# EAGLE design PIC 16F877A Board_V3 (SMD) (EAGLE 9.6.2)
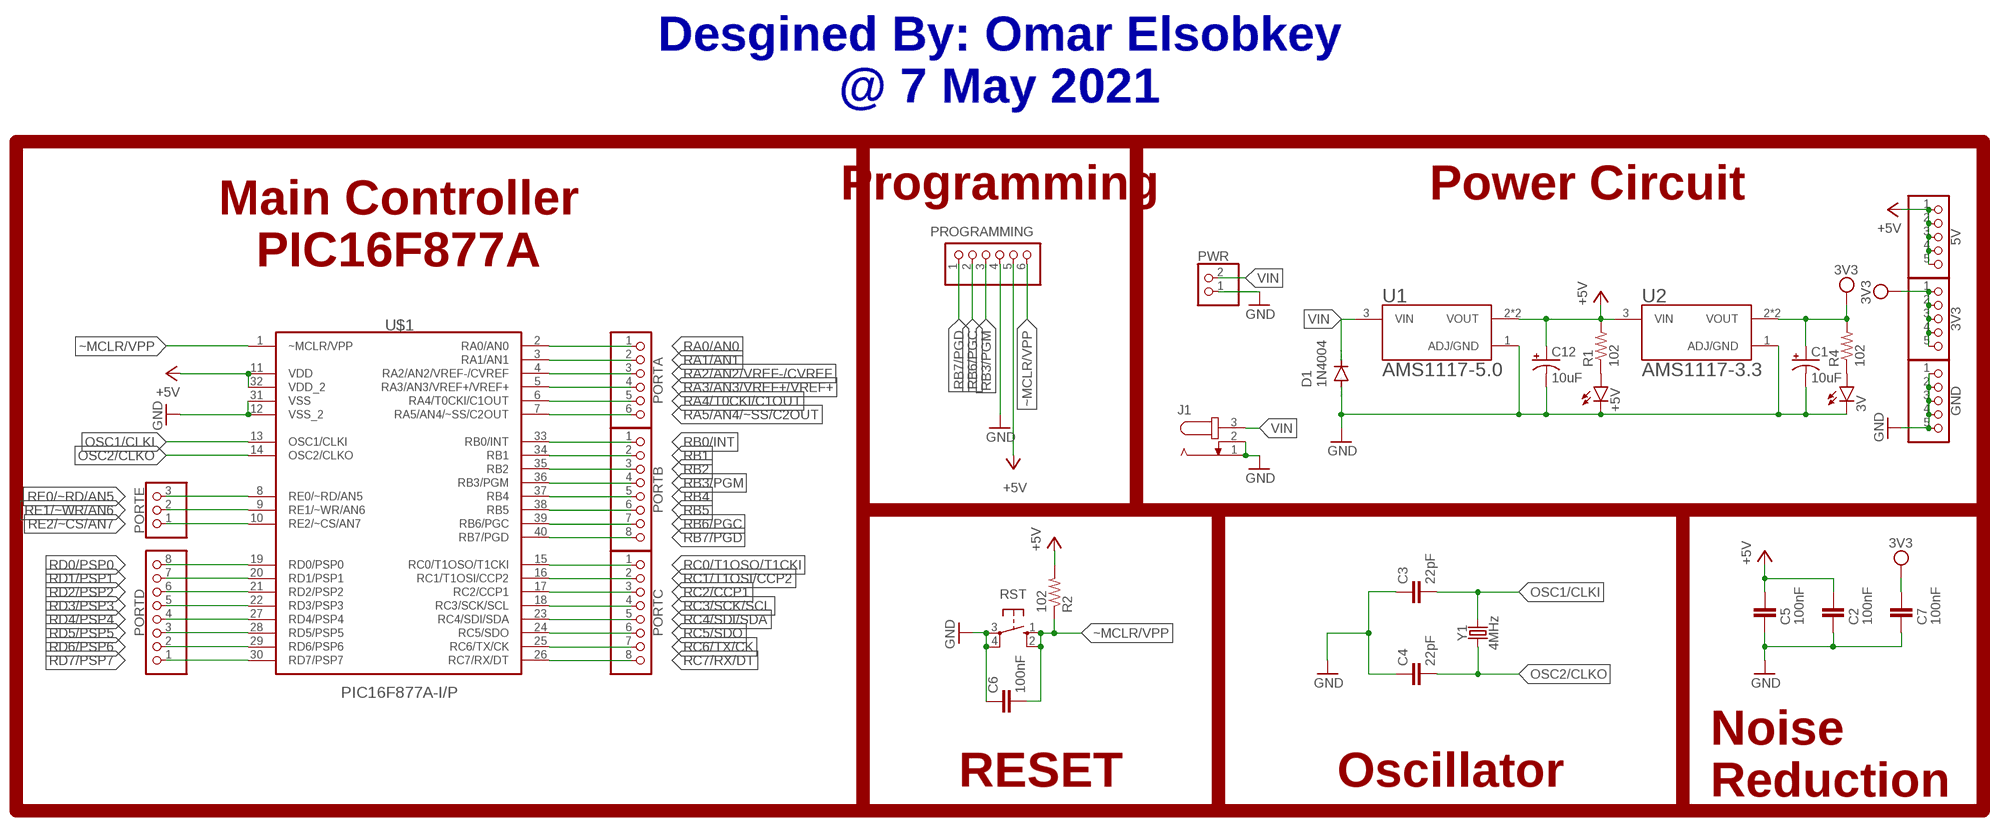
[diagram p0: schematic, sheet 1]

## Parts
3V  LEDSML0805  [SML0805]
3V3  PINHD-1X5  [1X05]
5V  PINHD-1X5  [1X05]
+5V  LEDSML0805  [SML0805]
C1  10uF  10UF-POLAR-RADIAL-2.5MM-KIT-25V-20%  [CPOL-RADIAL-2.5MM-5MM-KIT]
C2  100nF  C-EU025-025X050  [C025-025X050]
C3  22pF  C-EU025-025X050  [C025-025X050]
C4  22pF  C-EU025-025X050  [C025-025X050]
C5  100nF  C-EU025-025X050  [C025-025X050]
C6  100nF  C-EU025-025X050  [C025-025X050]
C7  100nF  C-EU025-025X050  [C025-025X050]
C12  10uF  10UF-POLAR-RADIAL-2.5MM-KIT-25V-20%  [CPOL-RADIAL-2.5MM-5MM-KIT]
D1  1N4004  [DO41-10]
GND  PINHD-1X5  [1X05]
J1  JACK-PLUG0  [SPC4077]
PORTA  PINHD-1X6  [1X06]
PORTB  PINHD-1X8  [1X08]
PORTC  PINHD-1X8  [1X08]
PORTD  PINHD-1X8  [1X08]
PORTE  PINHD-1X3  [1X03]
PROGRAMMING  PINHD-1X6  [1X06]
PWR  PINHD-1X2  [1X02]
R1  102  RESISTOR1206  [1206]
R2  102  RESISTOR1206  [1206]
R4  102  RESISTOR1206  [1206]
RST  10-XX  [B3F-10XX]
U1  AMS1117-5.0  [AMS1117-5.0]
U2  AMS1117-3.3  AMS1117-5.0  [AMS1117-5.0]
U$1  PIC16F877A-I/P  [16F877A]
Y1  4MHz  CRYSTALPTH-HC49UV  [HC49U]

## Nets
3V3: 3V3.1 3V3.2 3V3.3 3V3.4 3V3.5 C1.1(+) C7.2 R4.2 U2.2(VOUT) U2.4(VOUT)
+5V: 5V.1 5V.2 5V.3 5V.4 5V.5 C2.2 C5.2 C12.1(+) PROGRAMMING.5 R1.2 R2.2 U1.2(VOUT) U1.4(VOUT) U2.3(VIN) U$1.11(VDD) U$1.32(VDD_2)
GND: 3V.C +5V.C C1.2(-) C2.1 C3.1 C4.1 C5.1 C6.1 C7.1 C12.2(-) D1.A GND.1 GND.2 GND.3 GND.4 GND.5 J1.1 J1.2 PROGRAMMING.4 PWR.1 RST.3(P) RST.4(P1) U1.1(ADJ/GND) U2.1(ADJ/GND) U$1.12(VSS_2) U$1.31(VSS)
N$1: 3V.A R4.1
N$4: +5V.A R1.1
OSC1/CLKI: C3.2 U$1.13(OSC1/CLKI) Y1.2
OSC2/CLKO: C4.2 U$1.14(OSC2/CLKO) Y1.1
RA0/AN0: PORTA.1 U$1.2(RA0/AN0)
RA1/AN1: PORTA.2 U$1.3(RA1/AN1)
RA2/AN2/VREF-/CVREF: PORTA.3 U$1.4(RA2/AN2/VREF-/CVREF)
RA3/AN3/VREF+/VREF+: PORTA.4 U$1.5(RA3/AN3/VREF+/VREF+)
RA4/T0CKI/C1OUT: PORTA.5 U$1.6(RA4/T0CKI/C1OUT)
RA5/AN4/~SS/C2OUT: PORTA.6 U$1.7(RA5/AN4/~SS/C2OUT)
RB0/INT: PORTB.1 U$1.33(RB0/INT)
RB1: PORTB.2 U$1.34(RB1)
RB2: PORTB.3 U$1.35(RB2)
RB3/PGM: PORTB.4 PROGRAMMING.3 U$1.36(RB3/PGM)
RB4: PORTB.5 U$1.37(RB4)
RB5: PORTB.6 U$1.38(RB5)
RB6/PGC: PORTB.7 PROGRAMMING.2 U$1.39(RB6/PGC)
RB7/PGD: PORTB.8 PROGRAMMING.1 U$1.40(RB7/PGD)
RC0/T1OSO/T1CKI: PORTC.1 U$1.15(RC0/T1OSO/T1CKI)
RC1/T1OSI/CCP2: PORTC.2 U$1.16(RC1/T1OSI/CCP2)
RC2/CCP1: PORTC.3 U$1.17(RC2/CCP1)
RC3/SCK/SCL: PORTC.4 U$1.18(RC3/SCK/SCL)
RC4/SDI/SDA: PORTC.5 U$1.23(RC4/SDI/SDA)
RC5/SDO: PORTC.6 U$1.24(RC5/SDO)
RC6/TX/CK: PORTC.7 U$1.25(RC6/TX/CK)
RC7/RX/DT: PORTC.8 U$1.26(RC7/RX/DT)
RD0/PSP0: PORTD.8 U$1.19(RD0/PSP0)
RD1/PSP1: PORTD.7 U$1.20(RD1/PSP1)
RD2/PSP2: PORTD.6 U$1.21(RD2/PSP2)
RD3/PSP3: PORTD.5 U$1.22(RD3/PSP3)
RD4/PSP4: PORTD.4 U$1.27(RD4/PSP4)
RD5/PSP5: PORTD.3 U$1.28(RD5/PSP5)
RD6/PSP6: PORTD.2 U$1.29(RD6/PSP6)
RD7/PSP7: PORTD.1 U$1.30(RD7/PSP7)
RE0/~RD/AN5: PORTE.3 U$1.8(RE0/~RD/AN5)
RE1/~WR/AN6: PORTE.2 U$1.9(RE1/~WR/AN6)
RE2/~CS/AN7: PORTE.1 U$1.10(RE2/~CS/AN7)
VIN: D1.C J1.3 PWR.2 U1.3(VIN)
~MCLR/VPP: C6.2 PROGRAMMING.6 R2.1 RST.1(S) RST.2(S1) U$1.1(~MCLR/VPP)

## Notes on the sheet
- Desgined By: Omar Elsobkey
  @ 7 May 2021
- Programming | Power Circuit
- Main Controller
  PIC16F877A
- RESET | Oscillator
- Noise
  Reduction

## Library data of the parts
3V +5V = led:LED: LED OSRAM: - CHIPLED LG R971, LG N971, LY N971, LG Q971, LY Q971, LO R971, LY R971 LH N974, LH R974 LS Q976, LO Q976, LY Q976 LO Q996 - Hyper CHIPLED LW Q18S LB Q993, LB Q99A, LB R99A - SideLED LS A670, LO A670, LY A670, LG A670, LP A670 LB A673, LV A673, LT A673, LW A673 LH A674 LY A675 LS A676, LA A676, LO A676, LY A676, LW A676 LS A679, LY A679, LG A679 - Hyper Micro SIDELED® LS Y876, LA Y876, LO Y876, LY Y876 LT Y87S - SmartLED LW L88C, LW L88S LB L89C, LB L89S, LG L890 LS L89K, LO L89K, LY L89K LS L896, LA L896, LO L896, LY L896 - TOPLED LS T670, LO T670, LY T670, LG T670, LP T670 LSG T670, LSP T670, LSY T670, LOP T670, LYG T670 LG T671, LOG T671, LSG T671 LB T673, LV T673, LT T673, LW T673 LH T674 LS T676, LA T676, LO T676, LY T676, LB T676, LH T676, LSB T676, LW T676 LB T67C, LV T67C, LT T67C, LS T67K, LO T67K, LY T67K, LW E67C LS E67B, LA E67B, LO E67B, LY E67B, LB E67C, LV E67C, LT E67C LW T67C LS T679, LY T679, LG T679 LS T770, LO T770, LY T770, LG T770, LP T770 LB T773, LV T773, LT T773, LW T773 LH T774 LS E675, LA E675, LY E675, LS T675 LS T776, LA T776, LO T776, LY T776, LB T776 LHGB T686 LT T68C, LB T68C - Hyper Mini TOPLED® LB M676 - Mini TOPLED Santana® LG M470 LS M47K, LO M47K, LY M47K Source: http://www.osram.convergy.de LUXEON: - LUMILED® LXK2-PW12-R00, LXK2-PW12-S00, LXK2-PW14-U00, LXK2-PW14-V00 LXK2-PM12-R00, LXK2-PM12-S00, LXK2-PM14-U00 LXK2-PE12-Q00, LXK2-PE12-R00, LXK2-PE12-S00, LXK2-PE14-T00, LXK2-PE14-U00 LXK2-PB12-K00, LXK2-PB12-L00, LXK2-PB12-M00, LXK2-PB14-N00, LXK2-PB14-P00, LXK2-PB14-Q00 LXK2-PR12-L00, LXK2-PR12-M00, LXK2-PR14-Q00, LXK2-PR14-R00 LXK2-PD12-Q00, LXK2-PD12-R00, LXK2-PD12-S00 LXK2-PH12-R00, LXK2-PH12-S00 LXK2-PL12-P00, LXK2-PL12-Q00, LXK2-PL12-R00 Source: www.luxeon.com KINGBRIGHT: KA-3528ASYC Source: www.kingbright.com
3V3 5V GND = pinhead:PINHD-1X5: PIN HEADER
C1 C12 = SparkFun-Capacitors:10UF-POLAR: 10.0µF polarized capacitors A capacitor is a passive two-terminal electrical component used to store electrical energy temporarily in an electric field.; PROD_ID: CAP-08440
C2-C7 = rcl:C-EU: CAPACITOR, European symbol; SPICEPREFIX: C
D1 = diode:1N4004: DIODE general purpose rectifier, 1 A
J1 = con-jack:JACK-PLUG: DC POWER JACK Power Jack, DC, Right Angle, Through Hole, Rated 5A at 16VDC, PC Terminals Distributor: Farnell (www.Farnell.de) Drawing: 84N1161.pdf / 84N1162.pdf Manufacturer: SPC Technology (www.spctechnology.com) Type: SPC4077 / SPC 4078; OC_FARNELL: unknown; OC_NEWARK: unknown
PORTA PROGRAMMING = pinhead:PINHD-1X6: PIN HEADER
PORTB PORTC PORTD = pinhead:PINHD-1X8: PIN HEADER
PORTE = pinhead:PINHD-1X3: PIN HEADER
PWR = pinhead:PINHD-1X2: PIN HEADER
R1 R2 R4 = SparkFun-Resistors:RESISTOR: Generic Resistor Package
RST = switch-omron:10-XX: OMRON SWITCH; MPN: B3F-1000; OC_FARNELL: 176432; OC_NEWARK: 36M3542
U1 U2 = AMS1117-5.0:AMS1117-5.0: Sot223/Pkg 1-Amp 5-Volt Low Drop Out Voltage Regulatator; AVAILABILITY: Unavailable; DESCRIPTION: Sot223/Pkg 1-Amp 5-Volt Low Drop Out Voltage Regulatator; MF: Advanced Monolithic Systems; MP: AMS1117-5.0; PACKAGE: None; PRICE: None
U$1 = PIC - 16F877A:PIC16F877A-I/P: 8-Bit CMOS FLASH Microcontrollers Check prices <https://pricing.snapeda.com/parts/PIC16F877A-I/P/Microchip/view-part?ref=eda>; AVAILABILITY: Good; DESCRIPTION: PIC PIC® 16F Microcontroller IC 8-Bit 20MHz 14KB (8K x 14) FLASH 44-TQFP (10x10); MF: Microchip; MP: PIC16F877A-I/P; PACKAGE: DIP-40 Microchip; PRICE: None; PURCHASE-URL: https://pricing.snapeda.com/search/part/PIC16F877A-I/P/?ref=eda
Y1 = SparkFun-Clocks:CRYSTAL: Crystals (Generic) These are passive quartz crystals, which can be used as a clock source for a microcontroller. Crystal's are two-terminal devices. They require external "load" capacitors to generate an oscillating signal.

## Board
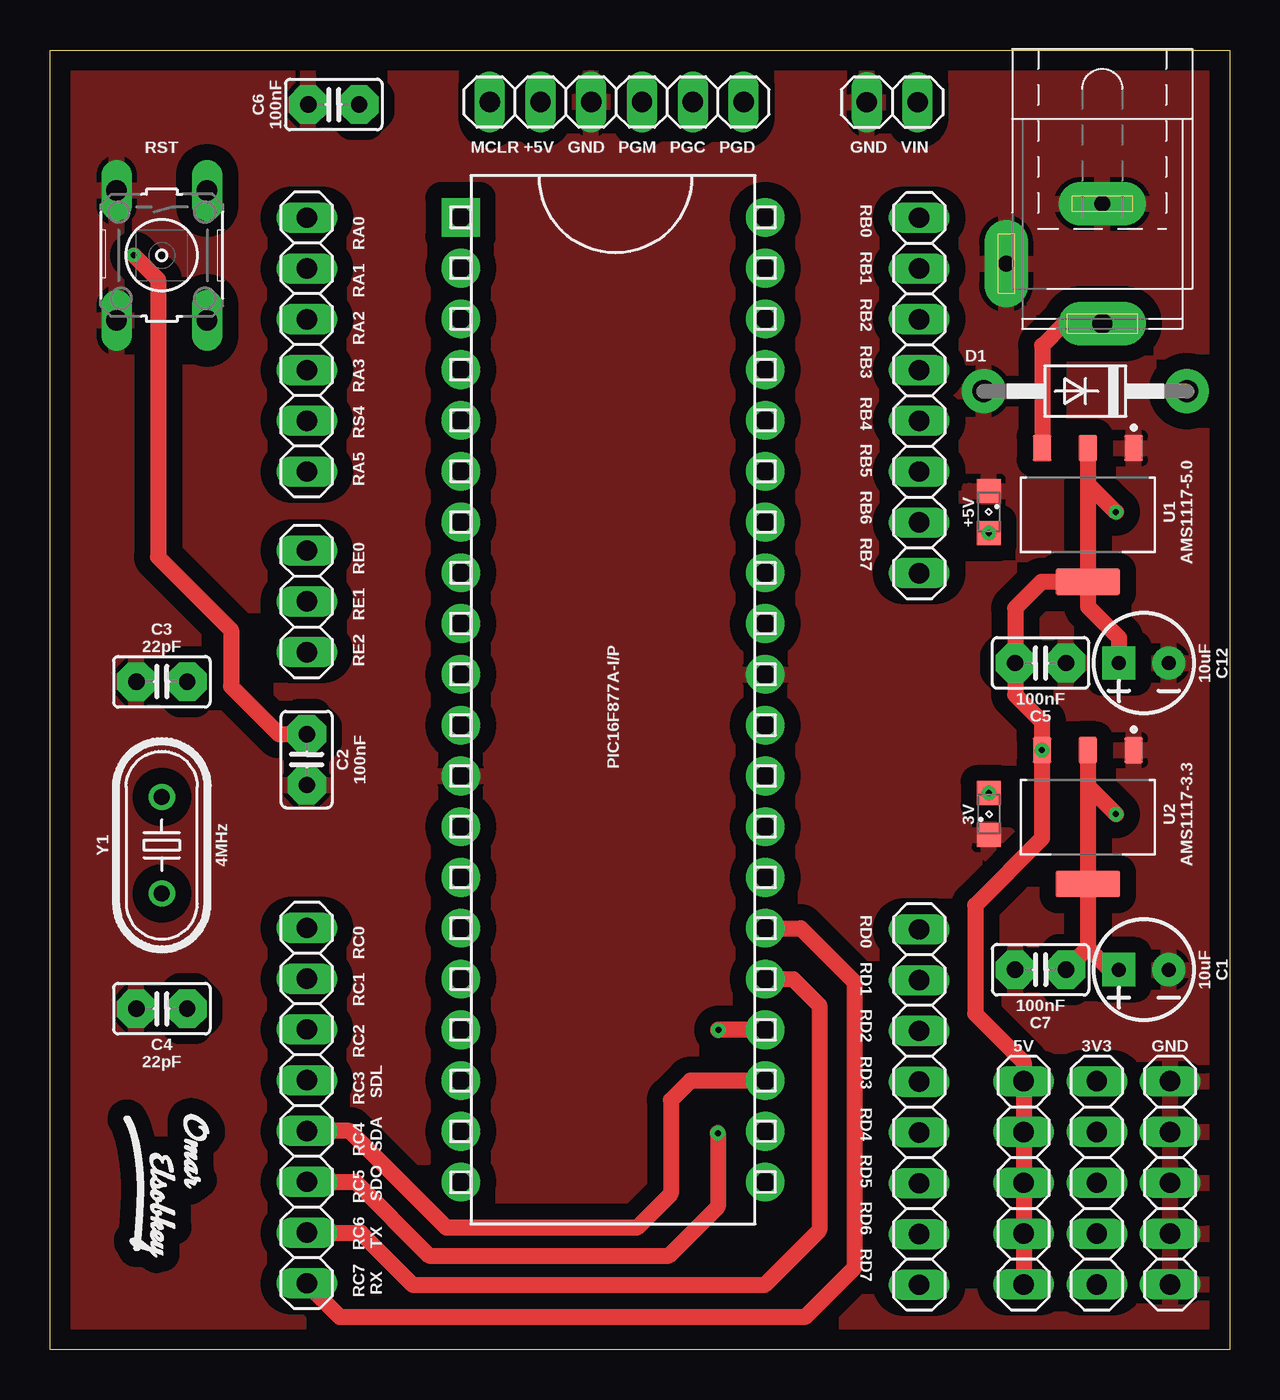
[diagram p1: board, top side]
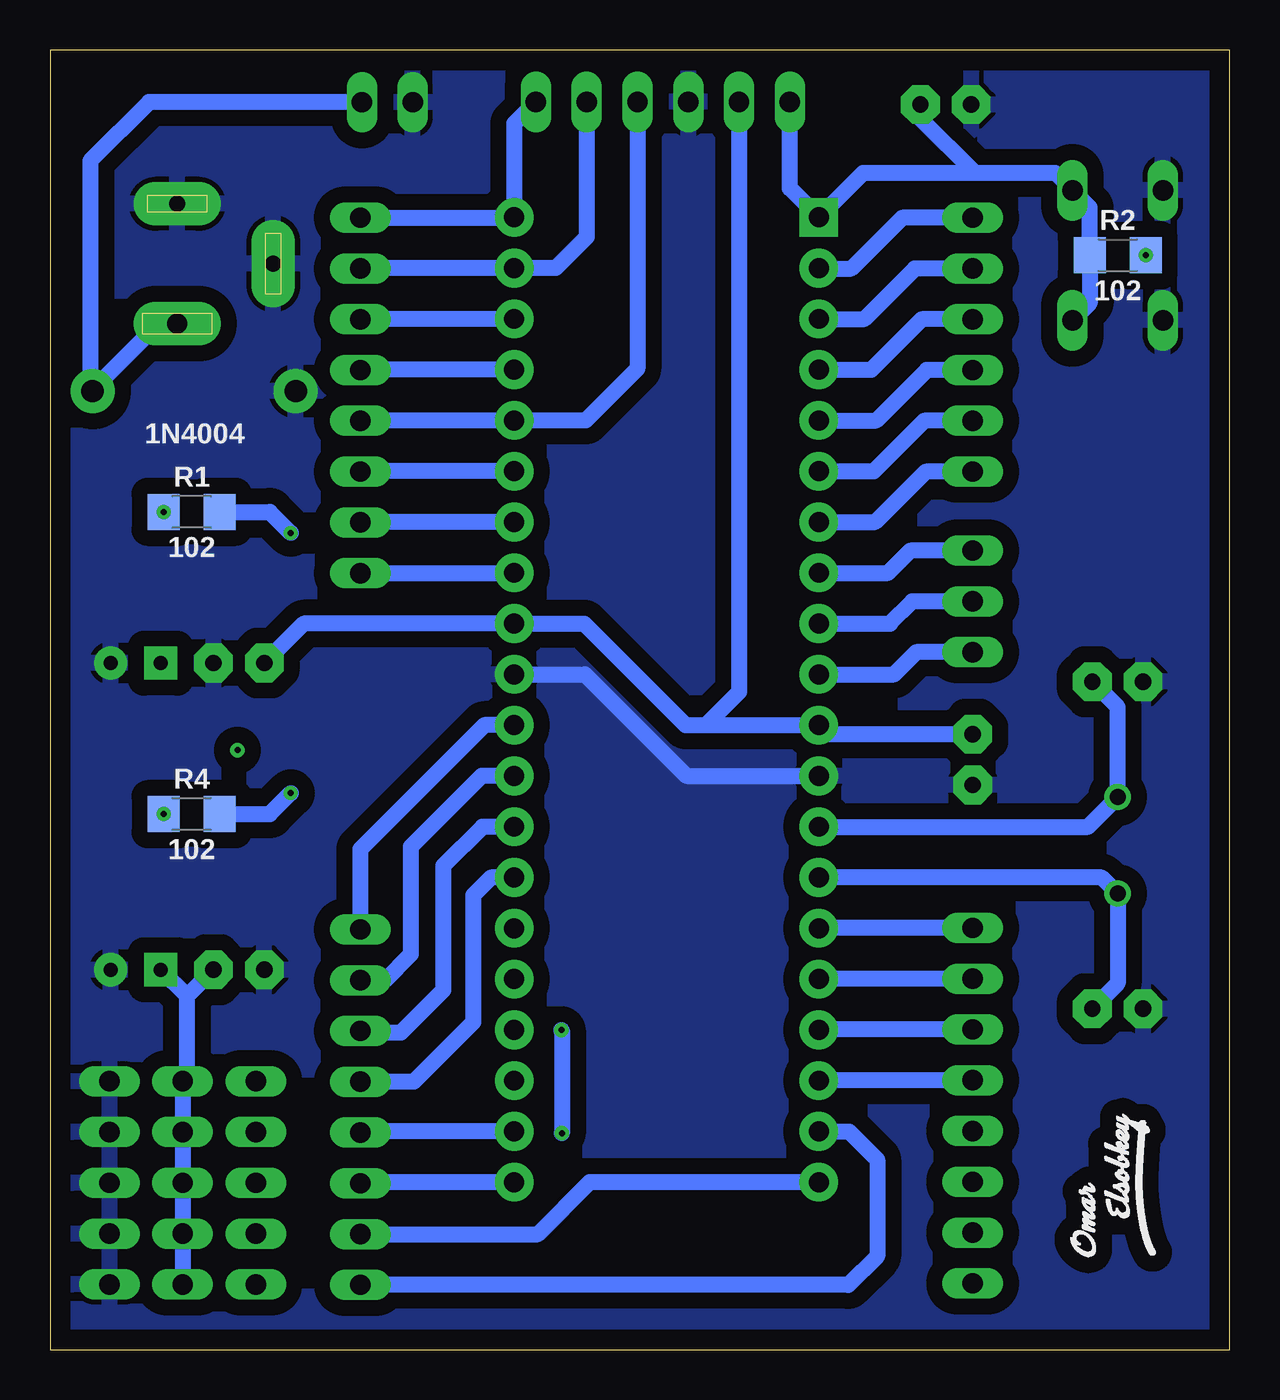
[diagram p2: board, bottom side, seen from below]

Size 59 x 65 mm. Coordinates in mm from the lower left corner, seen from the top.
Outline: 0,65 59,65 59,0 0,0 0,65
Copper layers (1*16): Top 0.035mm / dielectric 1.5mm / Bottom 0.035mm
Design rules "default *": minimum track width 0.8mm, minimum drill 0.3mm, track to track 0.6mm, track to pad 0.6mm, pad to pad 0.6mm, via to via 0.6mm, smd to smd 0.6mm, copper to edge 40mil, drill to drill 6mil, minimum pad ring 10mil, minimum via ring 8mil, stop-mask expansion 4mil, vias tented up to drill 0mil, thermal gap 10mil

### Footprints (pad centres in the part's own frame; a part is rotated, then mirrored left to right if it is on the bottom)
SML0805 = smd 1.2 x 1.2: A 1.05,0; C -1.05,0
1X05 = drill 1.016 long: 1 -5.08,0; 2 -2.54,0; 3 0,0; 4 2.54,0; 5 5.08,0
CPOL-RADIAL-2.5MM-5MM-KIT = drill 0.7 pad 1.651 square: 1 1.25,0 | drill 0.7 pad 1.651: 2 -1.25,0
C025-025X050 = drill 0.813 pad 1.93 octagon: 1 -1.27,0; 2 1.27,0
DO41-10 = drill 1.118 pad 2.2: A 5.08,0; C -5.08,0
SPC4077 = drill 0.8 pad 2.184 long: 1 -3,0; 2 0,-4.8 | drill 1 pad 2.184 long: 3 3,0
1X06 = drill 1.016 long: 1 -6.35,0; 2 -3.81,0; 3 -1.27,0; 4 1.27,0; 5 3.81,0; 6 6.35,0
1X08 = drill 1.016 long: 1 -8.89,0; 2 -6.35,0; 3 -3.81,0; 4 -1.27,0; 5 1.27,0; 6 3.81,0; 7 6.35,0; 8 8.89,0
1X03 = drill 1.016 long: 1 -2.54,0; 2 0,0; 3 2.54,0
1X02 = drill 1.016 long: 1 -1.27,0; 2 1.27,0
1206 = smd 1.6 x 1.8: 1 -1.4,0; 2 1.4,0
B3F-10XX = drill 1.016 long: 1 -3.251,2.261; 2 3.251,2.261; 3 -3.251,-2.261; 4 3.251,-2.261
AMS1117-5.0 = smd 0.93 x 1.31: 1 -2.29,-3.345; 2 0,-3.345; 3 2.29,-3.345 | smd 3.24 x 1.31: 4 0,3.345
16F877A = drill 0.991 pad 1.93 square: 1 -7.62,24.13 | drill 0.991 pad 1.93: 2 -7.62,21.59; 3 -7.62,19.05; 4 -7.62,16.51; 5 -7.62,13.97; 6 -7.62,11.43; 7 -7.62,8.89; 8 -7.62,6.35; 9 -7.62,3.81; 10 -7.62,1.27; 11 -7.62,-1.27; 12 -7.62,-3.81; 13 -7.62,-6.35; 14 -7.62,-8.89; 15 -7.62,-11.43; 16 -7.62,-13.97; 17 -7.62,-16.51; 18 -7.62,-19.05; 19 -7.62,-21.59; 20 -7.62,-24.13; 21 7.62,-24.13; 22 7.62,-21.59; 23 7.62,-19.05; 24 7.62,-16.51; 25 7.62,-13.97; 26 7.62,-11.43; 27 7.62,-8.89; 28 7.62,-6.35; 29 7.62,-3.81; 30 7.62,-1.27; 31 7.62,1.27; 32 7.62,3.81; 33 7.62,6.35; 34 7.62,8.89; 35 7.62,11.43; 36 7.62,13.97; 37 7.62,16.51; 38 7.62,19.05; 39 7.62,21.59; 40 7.62,24.13
HC49U = drill 0.813: 1 -2.413,0; 2 2.413,0

### Placement (x,y rotation side)
3V  46.96,26.78 90 top
3V3  52.37,8.34 90 top
5V  48.7,8.34 90 top
+5V  46.96,41.89 270 top
C1  54.71,19 180 top
C2  12.84,29.51 90 top
C3  5.59,33.4 0 top
C4  5.59,17.05 0 top
C5  49.55,34.34 180 top
C6  14.19,62.27 0 top
C7  49.55,19 0 top
C12  54.71,34.34 180 top
D1  51.79,47.94 180 top
GND  56.02,8.34 90 top
J1  52.63,54.31 270 top
PORTA  12.84,50.26 270 top
PORTB  43.48,47.72 90 top
PORTC  12.84,12.2 270 top
PORTD  43.48,12.12 270 top
PORTE  12.84,37.42 90 top
PROGRAMMING  28.34,62.4 180 top
PWR  42.12,62.39 0 top
R1  51.91,41.89 180 bottom
R2  5.59,54.73 0 bottom
R4  51.91,26.78 180 bottom
RST  5.59,54.73 270 top
U1  51.91,41.74 180 top
U2  51.91,26.63 180 top
U$1  28.16,32.5 0 top
U$2  [OMAR_ELSOBKEY_X0.5_TN]  5.62,8.54 270 top
U$3  [OMAR_ELSOBKEY_X0.5_TN]  5.62,7.86 90 bottom
U$4  [OMAR_ELSOBKEY_X0.5_T]  5.62,7.86 90 bottom
U$5  [OMAR_ELSOBKEY_X0.5_T]  5.62,8.54 270 top
Y1  5.59,25.23 90 top

### Tracks (layer width: path | path; a pad name or v marks a point on that pad's centre or on a via)
3V3  (via drill 0.3)
  Top 0.8: U2.2 51.91,28.18 | 51.91,28.18 R4.2 | 51.91,28.18 U2.4 51.91,20.09 | C7.2 51.91,20.09 | 51.91,20.09 53.01,19 C1.1
  Bottom 0.8: 52.14,17.68 52.14,13.64 3V3.5 3V3.4 3V3.3 3V3.2 3V3.1 | C7.2 52.14,17.68 | 52.14,17.68 C1.1 | C1.1
  other vias: 53.31,26.78
+5V  (via drill 0.3)
  Top 0.8: U1.2 51.91,43.29 | 51.91,43.29 R1.2 | 51.91,43.29 U1.4 | 49.62,30.55 U2.3 | 5V.1 5V.2 5V.3 5V.4 5V.5 48.7,14.38 46.27,16.8 46.27,22.23 49.62,25.57 U2.3 | R2.2 5.4,53.52 5.4,39.65 9.05,36 9.05,33.17 11.45,30.78 C2.2 | U1.4 51.91,37.16 53.46,35.61 C12.1 | U1.4 49.6,38.4 48.28,37.08 C5.2 48.28,32.74 49.62,31.4 U2.3
  Bottom 0.8: 26.2,31.23 27.2,31.23 32.28,36.31 U$1.32 46.3,36.31 C5.2 | 26.2,31.23 U$1.11 20.09,30.78 C2.2 | C2.2 | PROGRAMMING.5 24.53,32.9 26.2,31.23
  other vias: 53.31,41.89 49.62,29.98 4.19,54.73
GND
  Bottom 0.8: U$1.31 32.24,33.77 27.16,28.69 U$1.12
  pour Bottom (isolate 0.8): -1.2,65.97 60.38,65.97 60.38,-1.05 -1.2,-1.05
  pour Top (isolate 0.8): -2.9,67.3 61.95,67.3 61.95,-2.4 -2.9,-2.4
N$1  (via drill 0.3)
  Bottom 0.8: R4.1 48.01,26.78 3V.A
  other vias: 46.96,27.83
N$4  (via drill 0.3)
  Bottom 0.8: R1.1 48.01,41.89 +5V.A
  other vias: 46.96,40.84
OSC1/CLKI
  Bottom 0.8: U$1.13 7.08,26.15 Y1.2 5.59,32.13 C3.2
OSC2/CLKO
  Bottom 0.8: Y1.1 5.67,22.73 | Y1.1 5.59,18.32 C4.2 | Y1.1 6.39,23.61 U$1.14
RA0/AN0
  Bottom 0.8: PORTA.1 16.37,56.61 18.91,54.07 20.52,54.07 U$1.2
RA1/AN1
  Bottom 0.8: U$1.3 18.27,51.55 15.74,54.07 PORTA.2
RA2/AN2/VREF-/CVREF
  Bottom 0.8: U$1.4 17.91,49.01 15.39,51.53 PORTA.3
RA3/AN3/VREF+/VREF+
  Bottom 0.8: U$1.5 17.66,46.47 15.14,48.99 PORTA.4
RA4/T0CKI/C1OUT
  Bottom 0.8: U$1.6 17.79,43.93 15.27,46.45 PORTA.5
RA5/AN4/~SS/C2OUT
  Bottom 0.8: U$1.7 17.71,41.39 15.19,43.91 PORTA.6
RB0/INT
  Bottom 0.8: PORTB.1 35.81,38.83 U$1.33
RB1
  Bottom 0.8: U$1.34 43.46,41.39 PORTB.2
RB2
  Bottom 0.8: U$1.35 43.46,43.93 PORTB.3
RB3/PGM
  Bottom 0.8: PORTB.4 43.46,46.47 U$1.36 32.2,46.47 29.61,49.06 PROGRAMMING.3
RB4
  Bottom 0.8: U$1.37 43.46,49.01 PORTB.5
RB5
  Bottom 0.8: U$1.38 43.46,51.55 PORTB.6
RB6/PGC
  Bottom 0.8: PORTB.7 43.46,54.09 U$1.39 33.71,54.09 32.15,55.65 PROGRAMMING.2
RB7/PGD
  Bottom 0.8: PORTB.8 35.8,56.61 U$1.40 35.78,61.31 PROGRAMMING.1
RC0/T1OSO/T1CKI
  Bottom 0.8: PORTC.1 20.52,21.09 U$1.15
RC1/T1OSI/CCP2
  Bottom 0.8: PORTC.2 20.52,18.55 U$1.16
RC2/CCP1
  Bottom 0.8: PORTC.3 20.52,16.01 U$1.17
RC3/SCK/SCL
  Bottom 0.8: PORTC.4 20.52,13.47 U$1.18
RC4/SDI/SDA
  Top 0.8: U$1.23 32.02,13.45 31.05,12.47 31.05,7.8 29.35,6.1 19.82,6.1 14.99,10.93 PORTC.5
RC5/SDO  (via drill 0.3)
  Top 0.8: v33.4,10.82 33.4,7.15 30.95,4.7 18.97,4.7 15.28,8.39 PORTC.6 | U$1.24 33.44,15.99 v33.42,15.98
  Bottom 0.8: v33.42,15.98 33.4,15.95 v33.4,10.82
RC6/TX/CK
  Top 0.8: PORTC.7 15.54,5.85 18.17,3.23 35.73,3.23 38.48,5.97 38.48,17.23 37.17,18.53 U$1.25
RC7/RX/DT
  Top 0.8: PORTC.8 12.84,3.28 14.5,1.62 37.75,1.62 40.23,4.1 40.23,18.4 37.55,21.07 U$1.26
RD0/PSP0
  Bottom 0.8: U$1.19 19.04,10.91 17.62,9.5 17.62,4.67 19.07,3.23 PORTD.8
RD1/PSP1
  Bottom 0.8: U$1.20 32.01,8.37 34.6,5.78 PORTD.7
RD2/PSP2
  Bottom 0.8: U$1.21 43.43,8.37 PORTD.6
RD3/PSP3
  Bottom 0.8: U$1.22 43.43,10.91 PORTD.5
RD4/PSP4
  Bottom 0.8: U$1.27 36.94,23.61 37.83,22.73 37.83,16.38 40.8,13.39 PORTD.4
RD5/PSP5
  Bottom 0.8: U$1.28 37.38,26.15 39.33,24.2 39.33,17.98 41.45,15.85 43.4,15.85 PORTD.3
RD6/PSP6
  Bottom 0.8: U$1.29 37.41,28.69 40.95,25.15 40.95,19.77 42.25,18.48 PORTD.2
RD7/PSP7
  Bottom 0.8: U$1.30 37.27,31.23 43.48,25.02 PORTD.1
RE0/~RD/AN5
  Bottom 0.8: PORTE.3 15.97,39.96 17.08,38.85 U$1.8
RE1/~WR/AN6
  Bottom 0.8: U$1.9 16.98,36.31 15.87,37.42 PORTE.2
RE2/~CS/AN7
  Bottom 0.8: U$1.10 16.78,33.77 15.67,34.88 PORTE.1
VIN
  Top 0.8: U1.3 49.62,45.11 49.62,50.23 50.71,51.31 J1.3
  Bottom 0.8: J1.3 53.57,51.31 56.94,47.94 | 56.94,47.94 56.98,47.9 56.98,59.45 54.04,62.39 PWR.2 | 56.94,47.94 D1.C
~MCLR/VPP
  Bottom 0.8: RST.1 6.99,57.12 R2.1 6.99,52.34 RST.2 | RST.1 8.72,58.85 12.75,58.85 | 12.75,58.85 18.32,58.85 U$1.1 21.99,58.08 PROGRAMMING.6 | RST.1 7.59,57.98 | 12.75,58.85 15.46,61.56 C6.2

### Text on the board
tNames: MCLR +5V GND PGM PGC PGD | GND VIN | RB0 RB1 RB2 RB3 RB4 RB5 RB6 RB7 | RA5 RS4 RA3 RA2 RA1 RA0 | RE2 RE1 RE0 | RD0 RD1 RD2 RD3 RD4 RD5 RD6 RD7 | SDO SDA SDL | RC7 RC6 RC5 RC4 RC3 RC2 RC1 RC0 | RX TX